# EAGLE design backboard (EAGLE 9.0.1)
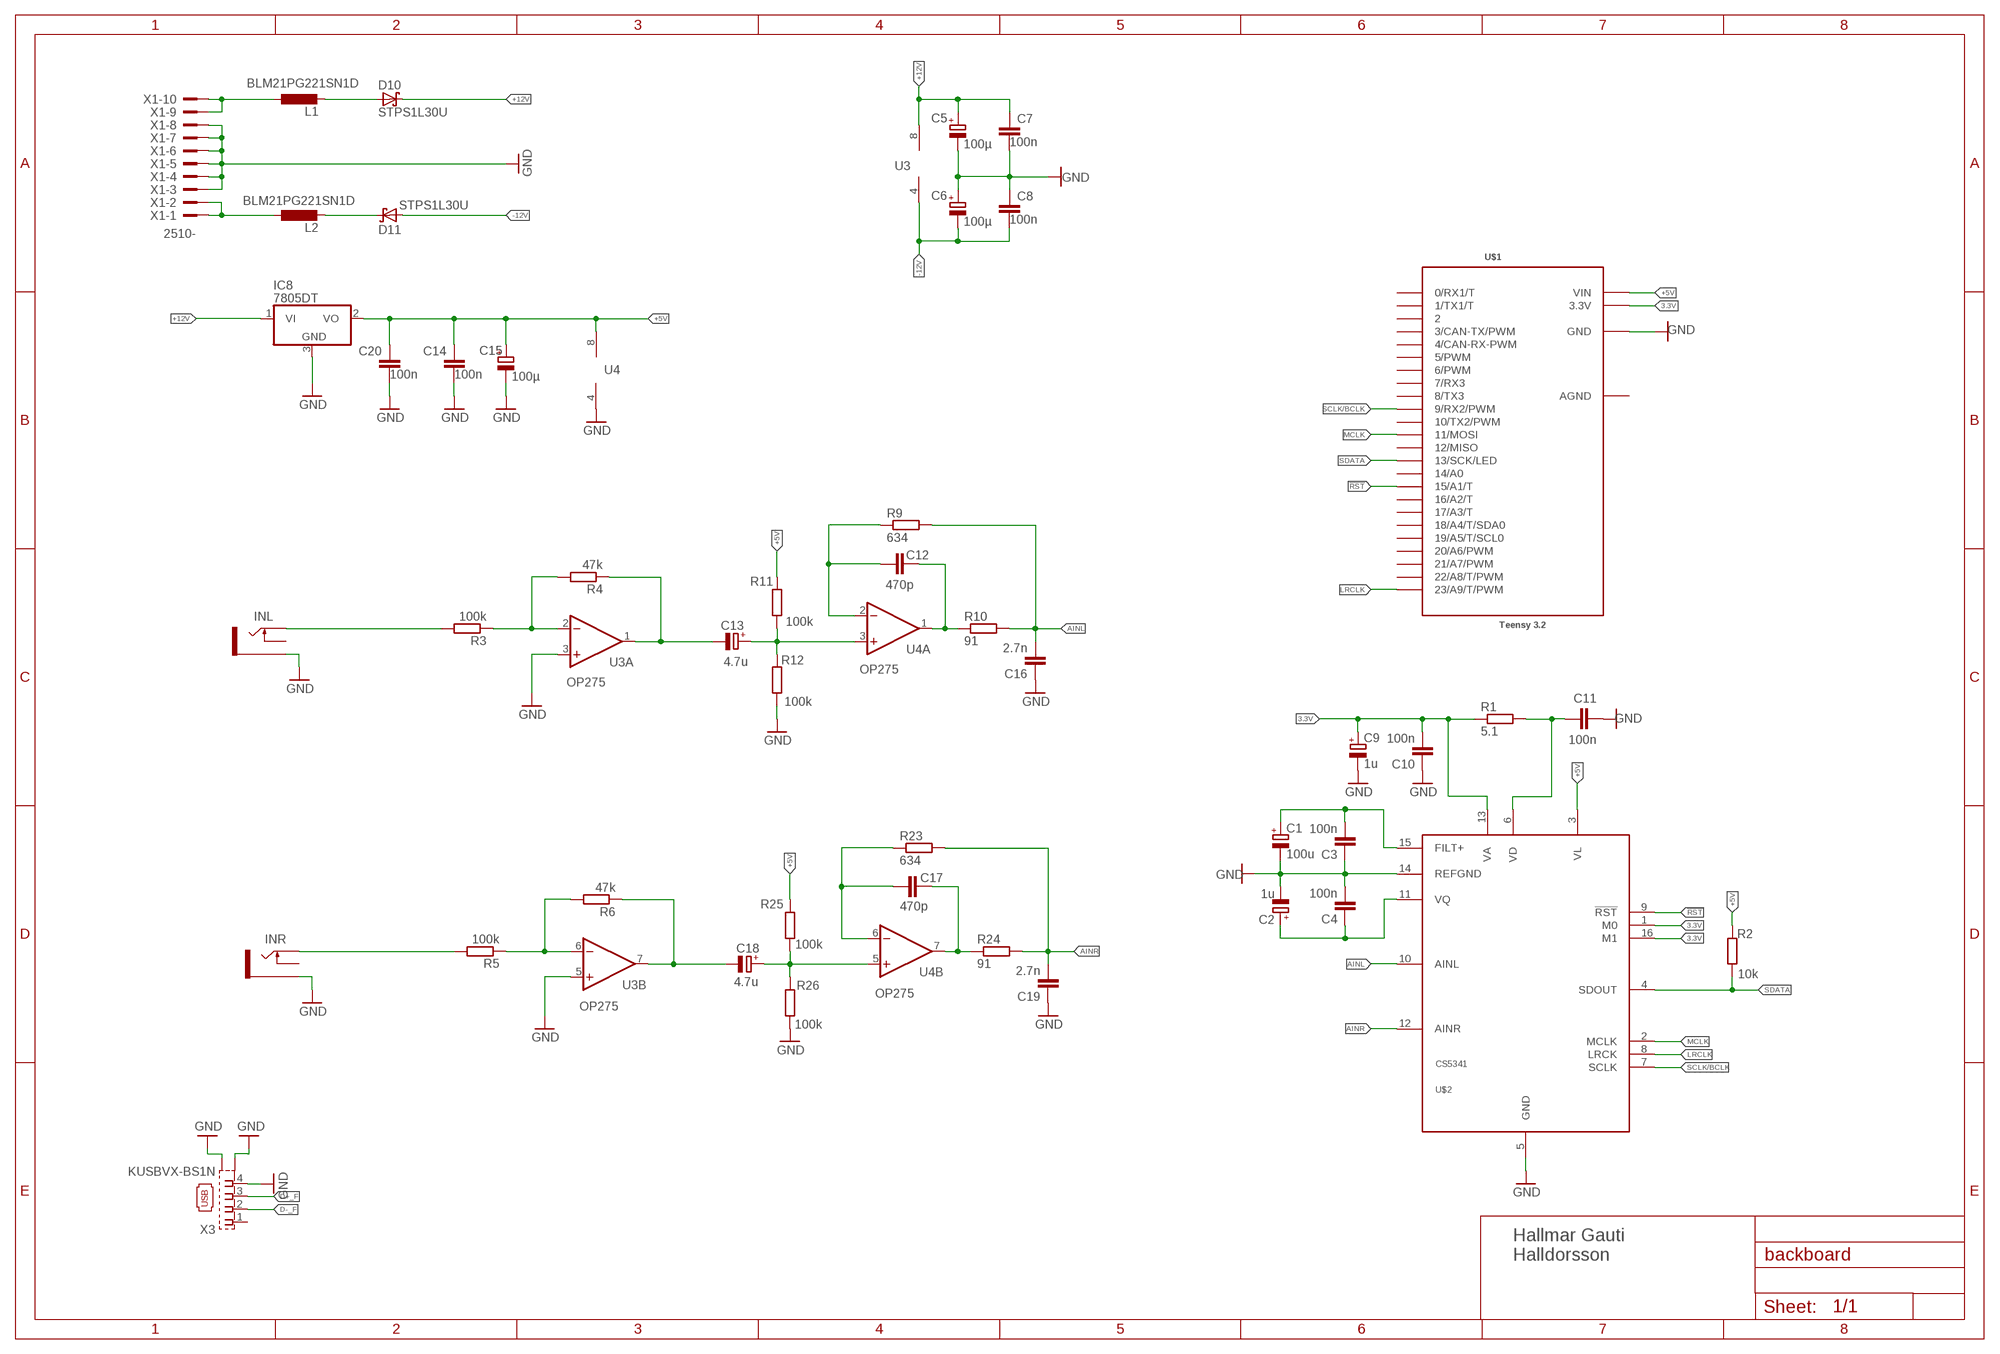
[diagram p0: schematic, sheet 1]

## Parts
C1  100u  CPOL-EU153CLV-0605  [153CLV-0605]
C2  1u  CPOL-EU153CLV-0405  [153CLV-0405]
C3  100n  C-EUC0805  [C0805]
C4  100n  C-EUC0805  [C0805]
C5  100µ  CPOL-EU153CLV-0505  [153CLV-0505]
C6  100µ  CPOL-EU153CLV-0505  [153CLV-0505]
C7  100n  C-EUC0805  [C0805]
C8  100n  C-EUC0805  [C0805]
C9  1u  CPOL-EU153CLV-0405  [153CLV-0405]
C10  100n  C-EUC0805  [C0805]
C11  100n  C-EUC0805  [C0805]
C12  470p  C-EUC0805  [C0805]
C13  4.7u  CPOL-EU153CLV-0405  [153CLV-0405]
C14  100n  C-EUC0805  [C0805]
C15  100µ  CPOL-EU153CLV-0505  [153CLV-0505]
C16  2.7n  C-EUC0805  [C0805]
C17  470p  C-EUC0805  [C0805]
C18  4.7u  CPOL-EU153CLV-0405  [153CLV-0405]
C19  2.7n  C-EUC0805  [C0805]
C20  100n  C-EUC0805  [C0805]
D10  STPS1L30U  MBRS130LT3  [SMB]
D11  STPS1L30U  MBRS130LT3  [SMB]
IC8  7805DT  [TO252]
INL  THONKICONN16PJ138  [WQP-PJ301M-12_JACK]
INR  THONKICONN16PJ138  [WQP-PJ301M-12_JACK]
L1  BLM21PG221SN1D  L-EUL2012C  [L2012C]
L2  BLM21PG221SN1D  L-EUL2012C  [L2012C]
R1  5.1  R-EU_M0805  [M0805]
R2  10k  R-EU_M0805  [M0805]
R3  100k  R-EU_M0805  [M0805]
R4  47k  R-EU_M0805  [M0805]
R5  100k  R-EU_M0805  [M0805]
R6  47k  R-EU_M0805  [M0805]
R9  634  R-EU_M0805  [M0805]
R10  91  R-EU_M0805  [M0805]
R11  100k  R-EU_M0805  [M0805]
R12  100k  R-EU_M0805  [M0805]
R23  634  R-EU_M0805  [M0805]
R24  91  R-EU_M0805  [M0805]
R25  100k  R-EU_M0805  [M0805]
R26  100k  R-EU_M0805  [M0805]
U3  OP275  TL072_SMD  [SO08]
U4  OP275  TL072_SMD  [SO08]
U$1  Teensy 3.2  TEENSY3.2.BAREBONES  [TEENSY3.2_BAREBONES]
U$2  CS5341  [TSSOP16]
X1  2510-  [PAK100/2500-10]
X3  KUSBVX-BS1N  [KUSBVX-BS1N]

## Nets
3.3V: C9.+ C10.2 R1.1 U$1.3.3V U$2.1(M0) U$2.13(VA) U$2.16(M1)
!RST: U$1.15/A1(15/A1/T) U$2.9(!RST)
+5V: C14.1 C15.+ C20.1 IC8.2(VO) R2.2 R11.2 R25.2 U4.8(P:V+) U$1.VIN U$2.3(VL)
+12V: C5.+ C7.1 D10.C IC8.1(VI) U3.8(P:V+)
-12V: C6.- C8.2 D11.A U3.4(P:V-)
AINL: C16.2 R9.2 R10.2 U$2.10(AINL)
AINR: C19.2 R23.2 R24.2 U$2.12(AINR)
D+_F: X3.3
D-_F: X3.2
GND: C1.- C2.- C3.1 C4.2 C5.- C6.+ C7.2 C8.1 C9.- C10.1 C11.1 C14.2 C15.- C16.1 C19.1 C20.2 IC8.3(GND) INL.P$3_SLEEVE(SLEEVE) INR.P$3_SLEEVE(SLEEVE) R12.1 R26.1 U3.3(A:+IN) U3.5(B:+IN) U4.4(P:V-) U$1.GND U$2.5(GND) U$2.14(REFGND) X1.3 X1.4 X1.5 X1.6 X1.7 X1.8 X3.4 X3.M1(S1) X3.M2(S2)
LRCLK: U$1.23/A9(23/A9/T/PWM) U$2.8(LRCK)
MCLK: U$1.11(11/MOSI) U$2.2(MCLK)
N$6: C2.+ C4.1 U$2.11(VQ)
N$7: C1.+ C3.2 U$2.15(FILT+)
N$8: C11.2 R1.2 U$2.6(VD)
N$9: INR.P$1_TIP(TIP) R5.2
N$10: INL.P$1_TIP(TIP) R3.2
N$13: C13.- R4.1 U3.1(A:OUT)
N$14: R3.1 R4.2 U3.2(A:-IN)
N$15: C18.- R6.1 U3.7(B:OUT)
N$22: R5.1 R6.2 U3.6(B:-IN)
N$24: C13.+ R11.1 R12.2 U4.3(A:+IN)
N$28: C12.2 R9.1 U4.2(A:-IN)
N$29: C12.1 R10.1 U4.1(A:OUT)
N$30: C18.+ R25.1 R26.2 U4.5(B:+IN)
N$31: C17.2 R23.1 U4.6(B:-IN)
N$32: C17.1 R24.1 U4.7(B:OUT)
N$46: L1.1 X1.9 X1.10
N$47: L2.1 X1.1 X1.2
N$49: D10.A L1.2
N$50: D11.C L2.2
SCLK/BCLK: U$1.9(9/RX2/PWM) U$2.7(SCLK)
SDATA: R2.1 U$1.13(13/SCK/LED) U$2.4(SDOUT)
Unconnected: INL.P$2_SWITCH(SWITCH) INR.P$2_SWITCH(SWITCH) U$1.0(0/RX1/T) U$1.1(1/TX1/T) U$1.2 U$1.3(3/CAN-TX/PWM) U$1.4(4/CAN-RX-PWM) U$1.5(5/PWM) U$1.6(6/PWM) U$1.7(7/RX3) U$1.8(8/TX3) U$1.10(10/TX2/PWM) U$1.12(12/MISO) U$1.14/A0 U$1.16/A2(16/A2/T) U$1.17/A3(17/A3/T) U$1.18/A4(18/A4/T/SDA0) U$1.19/A5(19/A5/T/SCL0) U$1.20/A6(20/A6/PWM) U$1.21/A7(21/A7/PWM) U$1.22/A8(22/A8/T/PWM) X3.1

## Notes on the sheet
- U3
- U4
- Hallmar Gauti 
  Halldorsson

## Power pins joined to a net without a drawn wire
AGND: U$1.AGND

## Library data of the parts
C1 C2 C5 C6 C9 C13 C15 C18 = resistor:CPOL-EU: POLARIZED CAPACITOR, European symbol
C3 C4 C7 C8 C10-C12 C14 C16 C17 C19 C20 = resistor:C-EU: CAPACITOR, European symbol
D10 D11 = diode:MBRS130LT3: Schottky Power Rectifier Source: http://www.onsemi.com/pub/Collateral/MBRS130LT3-D.PDF
IC8 = linear:78*: Positive VOLTAGE REGULATOR Source: http://cache.national.com/ds/LM/LM78L05.pdf http://www.fairchildsemi.com/ds/LM/LM7805.pdf
INL INR = MusicThingModular:THONKICONN: 3.5mm socket for Eurorack modular synths
L1 L2 = resistor:L-EU: INDUCTOR, European symbol
R1-R6 R9-R12 R23-R26 = resistor:R-EU_: RESISTOR, European symbol
U3 U4 = MusicThingModular:TL072: Generic Dual Op Amp
U$1 = hallmar-lib:TEENSY3.2.BAREBONES
U$2 = hallmar-lib:CS5341
X1 = con-3m:2510-: 3M (TM) Pak 100 4-Wall Header Source: 3M; MF: 3M; MPN: 2510-6002UB; OC_FARNELL: 9838244; OC_NEWARK: 46F4725
X3 = con-kycon:KUSBVX-BS1N: USB B-type Receptacle Vertical, 4 Position, Through Hole Source: Sibalco Kycon KUSBVX-BS1N-xxx.pdf

## Board
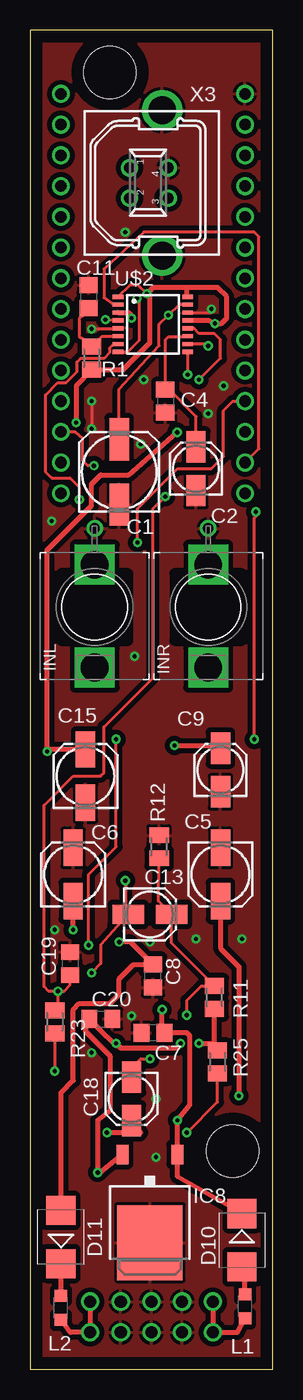
[diagram p1: board, top side]
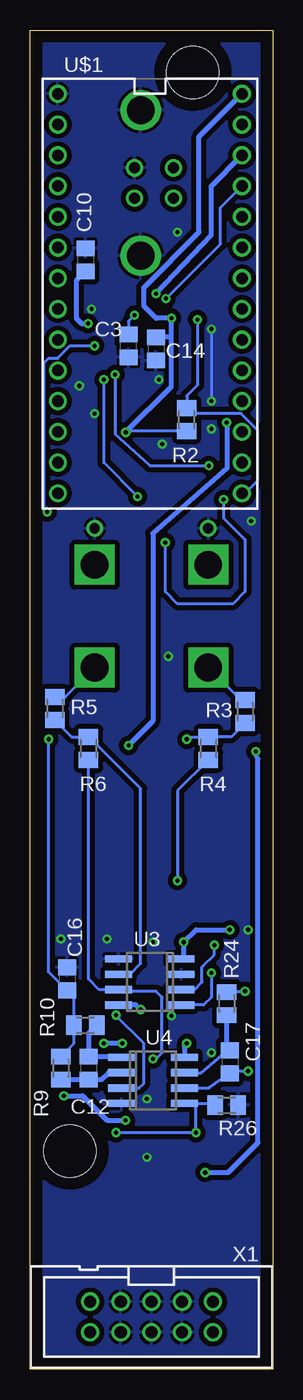
[diagram p2: board, bottom side, seen from below]

Size 20.07 x 110.67 mm. Coordinates in mm from the lower left corner, seen from the top.
Outline: 0,110.67 0,0 20.07,0 20.07,110.67 0,110.67
Copper layers (1*16): Top 0.035mm / dielectric 1.5mm / Bottom 0.035mm
Design rules "default": minimum track width 6mil, minimum drill 0.35mm, track to track 6mil, track to pad 6mil, pad to pad 6mil, via to via 6mil, smd to smd 6mil, copper to edge 40mil, drill to drill 6mil, minimum pad ring 10mil, minimum via ring 8mil, stop-mask expansion 4mil, vias tented up to drill 0mil, thermal gap 10mil
Holes 4.32 mm at 16.76,18.03 6.6,107.19

### Footprints (pad centres in the part's own frame; a part is rotated, then mirrored left to right if it is on the bottom)
153CLV-0605 = smd 3.5 x 1.6: + 2.7,0; - -2.7,0
153CLV-0405 = smd 2.6 x 1.6: + 1.8,0; - -1.8,0
C0805 = smd 1.3 x 1.5: 1 -0.95,0; 2 0.95,0
153CLV-0505 = smd 3 x 1.6: + 2.2,0; - -2.2,0
SMB = smd 2.4 x 2.4: A 2.2,0; C -2.2,0
TO252 = smd 1 x 1.6: 1 -2.28,-4.8; 2 2.28,-4.8 | smd 5.4 x 6.2: 3 0,2.5
WQP-PJ301M-12_JACK = drill 2.286 pad 2.413 square: P$1_TIP 0,5; P$2_SWITCH 0,-3.5 | drill 0.85: P$3_SLEEVE 0,-6.5
L2012C = smd 1 x 1: 1 -1,0; 2 1,0
M0805 = smd 1.3 x 1.6: 1 -0.95,0; 2 0.95,0
SO08 = smd 0.6 x 2.2: 1 -1.905,-2.6; 2 -0.635,-2.6; 3 0.635,-2.6; 4 1.905,-2.6; 5 1.905,2.6; 6 0.635,2.6; 7 -0.635,2.6; 8 -1.905,2.6
TEENSY3.2_BAREBONES = drill 0.965: 0 -7.62,12.7; 1 -7.62,10.16; 2 -7.62,7.62; 3 -7.62,5.08; 3.3V 7.62,10.16; 4 -7.62,2.54; 5 -7.62,0; 6 -7.62,-2.54; 7 -7.62,-5.08; 8 -7.62,-7.62; 9 -7.62,-10.16; 10 -7.62,-12.7; 11 -7.62,-15.24; 12 -7.62,-17.78; 13 7.62,-17.78; 14/A0 7.62,-15.24; 15/A1 7.62,-12.7; 16/A2 7.62,-10.16; 17/A3 7.62,-7.62; 18/A4 7.62,-5.08; 19/A5 7.62,-2.54; 20/A6 7.62,0; 21/A7 7.62,2.54; 22/A8 7.62,5.08; 23/A9 7.62,7.62; AGND 7.62,12.7; GND -7.62,15.24; VIN 7.62,15.24
TSSOP16 = smd 0.9 x 0.35: 1 -2.875,2.275; 2 -2.875,1.625; 3 -2.875,0.975; 4 -2.875,0.325; 5 -2.875,-0.325; 6 -2.875,-0.975; 7 -2.875,-1.625; 8 -2.875,-2.275; 9 2.875,-2.275; 10 2.875,-1.625; 11 2.875,-0.975; 12 2.875,-0.325; 13 2.875,0.325; 14 2.875,0.975; 15 2.875,1.625; 16 2.875,2.275
PAK100/2500-10 = drill 1 pad 1.422: 1 -5.08,-1.27; 2 -5.08,1.27; 3 -2.54,-1.27; 4 -2.54,1.27; 5 0,-1.27; 6 0,1.27; 7 2.54,-1.27; 8 2.54,1.27; 9 5.08,-1.27; 10 5.08,1.27
KUSBVX-BS1N = drill 0.9 pad 1.422: 1 1.25,2.7; 2 -1.25,2.7; 3 -1.25,-0.5; 4 1.25,-0.5 | drill 2.3 pad 2.7: M1 -6.02,0; M2 6.02,0

### Placement (x,y rotation side)
C1  7.37,74.17 90 top
C2  13.72,74.42 90 top
C3  11.94,84.58 90 bottom
C4  11.18,80.01 270 top
C5  15.75,40.89 270 top
C6  3.56,40.89 90 top
C7  10.16,27.81 180 top
C8  10.16,32.51 90 top
C9  15.75,49.53 90 top
C10  15.49,91.69 270 bottom
C11  4.83,88.65 270 top
C12  15.24,24.89 270 bottom
C13  9.91,37.59 0 top
C14  9.65,84.33 270 bottom
C15  4.57,49.02 90 top
C16  17.02,32.26 270 bottom
C17  3.56,25.4 270 bottom
C18  8.38,22.35 270 top
C19  3.3,33.53 270 top
C20  5.84,28.96 0 top
D10  17.53,10.67 270 top
D11  2.54,10.92 90 top
IC8  9.91,12.95 180 top
INL  5.33,62.99 180 top
INR  14.73,62.99 180 top
L1  17.78,5.21 90 top
L2  2.54,5.08 90 top
R1  5.08,83.57 90 top
R2  7.11,78.49 270 bottom
R3  2.29,54.36 90 bottom
R4  5.33,51.31 90 bottom
R5  18.03,54.61 90 bottom
R6  15.24,51.31 90 bottom
R9  17.53,24.89 90 bottom
R10  15.49,28.45 180 bottom
R11  15.24,30.73 270 top
R12  10.67,43.18 270 top
R23  2.03,28.7 90 top
R24  3.81,30.23 90 bottom
R25  15.49,25.4 90 top
R26  3.81,21.84 180 bottom
U3  10.16,32 90 bottom
U4  9.91,23.88 270 bottom
U$1  10.16,90.17 0 bottom
U$2  10.16,86.36 0 top
X1  10.03,4.32 180 bottom
X3  10.92,98.04 90 top

### Tracks (layer width: path | path; a pad name or v marks a point on that pad's centre or on a via)
3.3V  (via drill 0.35)
  Top 0.254: U$2.16 12.95,88.72 | U$2.1 8.31,89.66 8.89,89.66 v9.65,88.9
  Top 0.406: v3.81,78.23 3.81,81.28 R1.1 7.69,82.62 9.91,84.84 9.91,88.65 v9.65,88.9 10.16,89.41 12.95,89.41 | v11.94,51.56 15.58,51.56 C9.+ | 12.95,89.41 15.49,89.41 16.26,88.65 16.26,86.87 15.82,86.43 v15.28,86.43 14.78,86.69 U$2.13 | 12.95,88.72 12.95,89.41
  Bottom 0.406: v3.81,78.23 3.81,74.42 9.91,69.09 9.91,53.59 v11.94,51.56 | U$1.3.3V 5.08,97.79 5.08,93.73 v9.65,88.9 | C10.2 16.26,89.98 16.26,86.87 15.82,86.43 v15.28,86.43
!RST  (via drill 0.35)
  Top 0.254: v13.04,82.22 U$2.9 | 5.33,74.68 v5.27,74.68 4.76,74.68 4.32,75.12 4.32,76.96 3.75,77.47 U$1.15/A1
  Bottom 0.254: v13.04,82.22 13.04,77.3 10.16,74.68 v5.27,74.68
+5V  (via drill 0.35)
  Top 0.254: 5.84,16.26 v5.59,16.26
  Top 0.406: U$2.3 8.12,87.33 8.36,87.12 v8.38,86.87 | IC8.2 7.65,17.78 5.84,16.26 | C15.+ 1.56,51.22 v1.39,51.05 1.39,67.69 5.08,71.37 5.08,73.15 5.84,73.91 8.13,73.91 v12.16,77.44 | R25.2 15.24,26.42 15.24,26.92 | 15.24,26.92 R11.2 | v12.45,26.92 12.19,26.54 7.49,26.54 v7.11,26.92 6.92,26.92 5.79,28.06 C20.1 4.89,28.51 | v13.97,26.92 15.24,26.92 | 4.57,28.45 4.57,27.94 6.6,25.91 6.6,21.34 5.59,20.57 v5.59,16.26 | 4.89,28.51 4.83,28.45 | 5.08,28.45 4.57,28.45 | 4.57,28.45 4.89,28.51
  Bottom 0.254: R2.2 12.06,77.54 v12.16,77.44
  Bottom 0.406: v8.38,86.87 8.57,86.87 | v5.59,16.26 3.68,16.26 1.22,18.72 1.22,50.47 1.55,51.05 v1.39,51.05 | v12.16,77.44 8.38,81.21 8.38,85.34 | 8.38,85.34 v8.38,86.87 | C14.1 9.59,85.34 8.38,85.34 | v8.38,86.87 8.64,86.87 | v8.38,86.87 9.65,86.87 10.67,87.88 10.67,89.41 6.1,93.98 6.1,101.85 U$1.VIN | v12.45,26.92 v13.97,26.92 | v7.11,26.92 7.31,26.73 U4.8
+12V  (via drill 0.35)
  Top 0.406: D10.C 12.19,15.92 IC8.1 v12.19,20.57 13.21,21.84 13.21,27.56 12.95,27.81 C7.1 10.92,28 v10.92,29.72 | C5.+ 15.75,34.8 17.27,33.27 v17.27,22.61
  Bottom 0.406: v17.27,22.61 15.75,22.61 13.72,20.57 v12.19,20.57 | v10.92,29.72 11.3,30.1 U3.8
-12V  (via drill 0.35)
  Top 0.406: D11.A 2.54,22.86 3.56,23.88 3.56,29.72 4.06,30.23 6.6,30.23 7.37,30.99 7.37,32.26 8.55,33.45 9.99,33.45 C8.2 8.32,35.31 v7.37,35.31 | v3.56,36.32 C6.-
  Bottom 0.406: U3.4 7.37,34.1 v7.37,35.31 6.35,36.32 v3.56,36.32
AINL  (via drill 0.35)
  Top 0.254: v18.54,52.07 18.54,70.36 18.92,70.74 18.92,70.87 v18.67,70.87 | v14.73,84.58 14.58,84.73 U$2.10
  Bottom 0.254: R9.2 16.44,26.92 R10.2 16.44,30.73 C16.2 18.54,32.83 v18.54,52.07 | v18.67,70.87 18.92,71.12 18.92,83.19 18.54,83.57 17.78,83.57 16.76,84.58 v14.73,84.58
AINR  (via drill 0.35)
  Top 0.254: 3.3,32.26 3.3,31.75 2.79,31.24 v2.29,31.24 | v2.29,31.24 2.29,29.97 | v2.29,31.24 1.52,31.24 1.14,31.62 1.14,46.61 3.56,49.02 5.84,49.02 6.1,49.28 6.1,53.09 10.16,57.15 10.16,71.12 v11.18,72.14 | U$2.12 13.53,86.03 13.97,85.6 15.24,85.6 15.75,85.09 15.75,83.57 v13.97,81.79
  Top 0.406: 3.3,32.26 C19.2 | 2.29,29.97 R23.2
  Bottom 0.254: 3.74,31.24 v2.29,31.24 | v11.18,72.14 13.97,74.93 v13.97,81.79
  Bottom 0.406: R24.2 3.74,31.24
GND  (via drill 0.35)
  Top 0.254: U$2.5 7.29,85.98 v5.08,85.98 | U$2.14 14.99,87.33 v14.99,87.63 | v5.08,80.01 v5.08,77.72
  Bottom 0.254: v5.08,85.98 v5.08,80.01
  other vias: 9.4,81.79 1.78,70.1 2.03,36.32 9.91,35.31 10.41,17.53 10.41,22.35 13.72,35.56 17.53,35.56 9.14,76.45 14.73,78.99 16,81.28 7.87,93.98 8.64,58.93 5.08,26.16 8.38,29.21
  pour Top (isolate 0.406): 0,110.49 20.07,110.49 20.07,0 0,0
  pour Bottom (isolate 0.406): 0,110.49 20.07,110.49 20.07,0 0,0
LRCLK  (via drill 0.35)
  Top 0.254: U$2.8 8.07,84.08 9.04,85.05 9.04,88.16 8.83,88.37 v8.83,88.5
  Bottom 0.254: 8.89,88.5 v8.83,88.5 4.32,93 4.32,96.01 U$1.23/A9
MCLK
  Top 0.254: U$1.11 18.92,76.07 18.92,93.6 18.54,93.98 9.4,93.98 6.1,90.93 6.1,88.55 6.92,87.98 U$2.2
N$6
  Top 0.254: C4.1 11.18,81.28 | 11.18,81.28 11.18,85.09 11.43,85.34 12.99,85.34 U$2.11 | C2.+ 13.72,78.74 11.18,81.28
N$7  (via drill 0.35)
  Top 0.254: U$2.15 12.35,87.98 v11.43,87.12 10.67,86.36 10.67,84.58 7.37,81.03 C1.+
  Bottom 0.254: v11.43,87.12 11.94,86.61 C3.2
N$8
  Top 0.254: C11.2 5.08,87.63 4.06,86.87 4.06,85.34 5.08,84.84 R1.2 5.95,85.39 U$2.6
N$9
  Bottom 0.254: INR.P$1_TIP 17.16,55.56 R5.2
N$10
  Bottom 0.254: INL.P$1_TIP 2.65,55.31
  Bottom 0.406: 2.65,55.31 R3.2
N$13  (via drill 0.35)
  Top 0.254: 7.86,37.35 5.84,35.07 5.84,33.53 v5.08,32.77 | v7.87,40.39 7.87,37.36
  Top 0.406: C13.- 7.87,37.36 7.86,37.35
  Bottom 0.254: v5.08,32.77 5.08,31.75 5.08,30.73 5.71,30.1 U3.1 | R4.1 7.87,47.82 v7.87,40.39
N$14  (via drill 0.35)
  Top 0.254: v4.83,35.05 4.83,40.89 7.11,43.18 v7.11,52.07
  Bottom 0.254: R3.1 3.43,52.26 R4.2 6.92,52.26 v7.11,52.07 | U3.2 6.48,31.37 5.84,32 5.84,33.27 5.72,33.37 4.83,34.26 v4.83,35.05
N$15  (via drill 0.35)
  Top 0.254: C18.- 8.38,24.89 9.14,25.65 v9.91,25.65
  Bottom 0.254: v9.91,25.65 9.65,25.65 9.14,26.16 9.14,30.73 9.65,31.24 12.63,31.24 | U3.7 14.35,31.37 15.24,32.26 R6.1
  Bottom 0.406: 12.63,31.24 U3.7
N$22
  Bottom 0.254: R5.1 16.63,52.26 R6.2 15.19,52.26 10.92,47.99 10.92,33.53 11.81,32.64 U3.6
N$24  (via drill 0.35)
  Top 0.254: R12.2 10.6,38.7 C13.+ 11.71,35.22 R11.1 14.16,31.68 12.95,30.48 v12.95,29.27
  Bottom 0.254: U4.3 11.05,23.24 10.67,23.62 10.67,26.92 12.95,29.21 v12.95,29.27
N$28
  Bottom 0.406: U4.2 13.59,24.51 14.16,23.94 C12.2 R9.1
N$29
  Bottom 0.406: U4.1 12.57,25.84 C12.1 15.24,27.75 R10.1
N$30  (via drill 0.35)
  Top 0.254: v12.95,19.56 15.49,22.1 R25.1
  Top 0.406: C18.+ 9.17,19.56 v6.35,19.56
  Bottom 0.254: 6.35,21.91 v6.35,19.56 v12.95,19.56 | U4.5 4.89,21.97
  Bottom 0.406: 6.35,21.91 U4.5 | 4.89,21.97 R26.2
N$31  (via drill 0.35)
  Top 0.254: R23.1 v2.03,24.64
  Bottom 0.254: U4.6 5.27,23.24 C17.2 | v2.03,24.64 3.74,24.64
  Bottom 0.406: 3.74,24.64 C17.2
N$32
  Bottom 0.254: U4.7 5.9,24.51 4.25,25.91 4.06,25.91 3.9,26.01 3.9,26.52 3.69,26.47 4.2,25.96 C17.1
  Bottom 0.406: C17.1 3.81,26.92 R24.1
N$46
  Top 0.406: X1.9 X1.10 17.13,3.05 L1.1
N$47
  Top 0.406: X1.1 X1.2 3.32,3.05 L2.1
N$49
  Top 0.406: 17.53,8.21 17.32,8.43 | 17.32,8.43 D10.A | 17.32,8.43 17.82,7.94 17.78,7.9 L1.2
N$50
  Top 0.406: L2.2 D11.C
SCLK/BCLK  (via drill 0.35)
  Top 0.254: U$2.7 7.09,84.67 6.85,84.67 6.56,84.38 6.56,84.01 6.09,83.55 4.16,83.55 3.87,83.25 3.87,82.44 2.96,81.53 2.29,81.53 1.27,80.52 1.27,74.17 1.78,73.66 3.3,73.66 4.06,72.9 v4.06,71.88 | v8.89,68.33 8.89,71.12 12.19,74.42 14.99,74.42 16,75.44 16,79.25 16.76,80.01 U$1.9
  Bottom 0.254: v4.06,71.88 4.06,70.36 2.29,68.58 2.29,64.26 3.3,63.25 7.87,63.25 8.89,64.26 v8.89,68.33
SDATA  (via drill 0.35)
  Top 0.254: v6.22,86.74 6.34,86.74 U$2.4
  Bottom 0.254: v6.22,86.74 6.22,81.35 7.11,80.46 R2.1 6.67,78.99 2.63,78.99 1.27,77.64 1.27,73.41 2.29,72.39 U$1.13